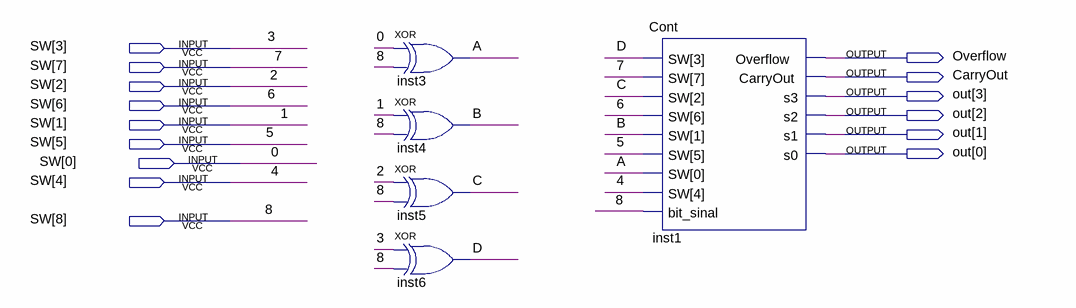
[diagram p0: schematic sheet]
// Quartus schematic SomaSubtrai.bdf as structural Verilog: 5 symbols, 15 pins
module SomaSubtrai (
  input  [8:0] SW,
  output Overflow,
  output CarryOut,
  output [3:0] out
);

  wire A, B, C, D;

  xor inst3 (A, SW[0], SW[8]);
  xor inst4 (B, SW[1], SW[8]);
  xor inst5 (C, SW[2], SW[8]);
  xor inst6 (D, SW[3], SW[8]);
  Cont inst1 (
    .SW({SW[7:4], D, C, B, A}), .bit_sinal(SW[8]), .Overflow(Overflow), .CarryOut(CarryOut), .s3(out[3]),
    .s2(out[2]), .s1(out[1]), .s0(out[0]));

  // Other names for the same wires on the sheet: 0 = SW[0]; 1 = SW[1]; 2 = SW[2]; 3 = SW[3]; 4 = SW[4]; 5 = SW[5];
  //   6 = SW[6]; 7 = SW[7]; 8 = SW[8]
endmodule
